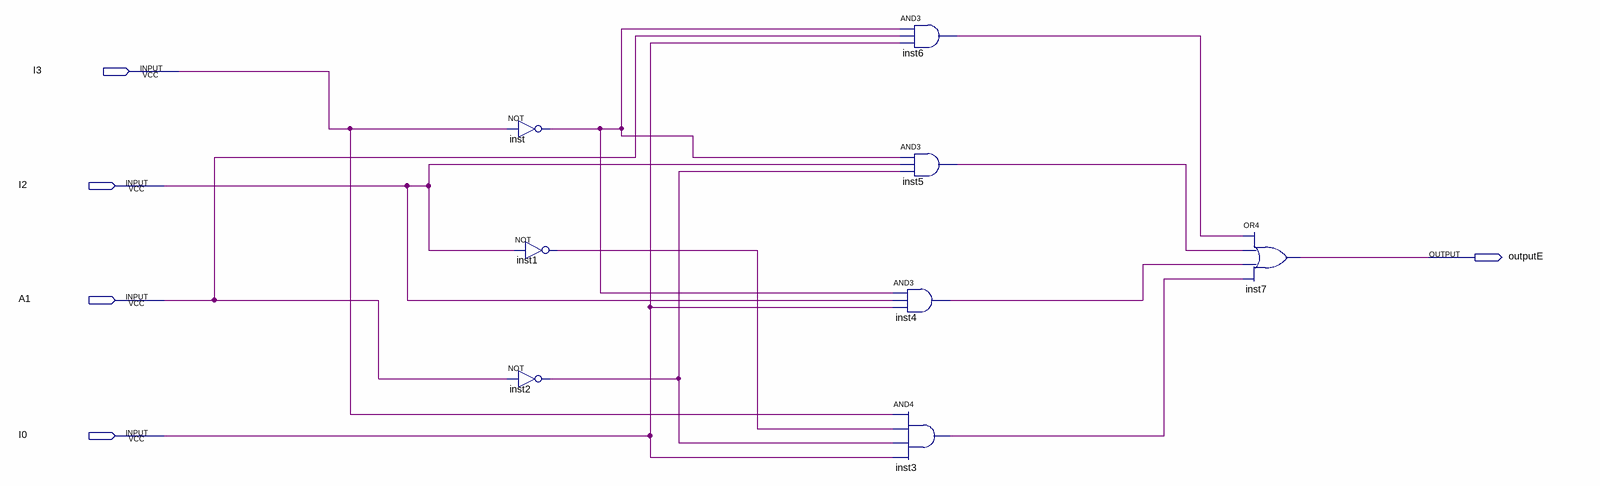
[diagram p0: schematic sheet]
// Quartus schematic outputE.bdf as structural Verilog: 8 symbols, 5 pins
module outputE (
  input  I3,
  input  I2,
  input  A1,
  input  I0,
  output outputE
);

  wire inst1_out, inst2_out, inst3_out, inst4_out, inst5_out, inst6_out, inst_out;

  not inst (inst_out, I3);
  not inst1 (inst1_out, I2);
  not inst2 (inst2_out, A1);
  and inst6 (inst6_out, inst_out, A1, I0);
  and inst5 (inst5_out, inst_out, I2, inst2_out);
  and inst4 (inst4_out, inst_out, I2, I0);
  and inst3 (inst3_out, I3, inst1_out, inst2_out, I0);
  or inst7 (outputE, inst6_out, inst5_out, inst4_out, inst3_out);
endmodule
